# Altium schematic sheet Mainboard_Breakbeam_Interface.SchDoc
size A4
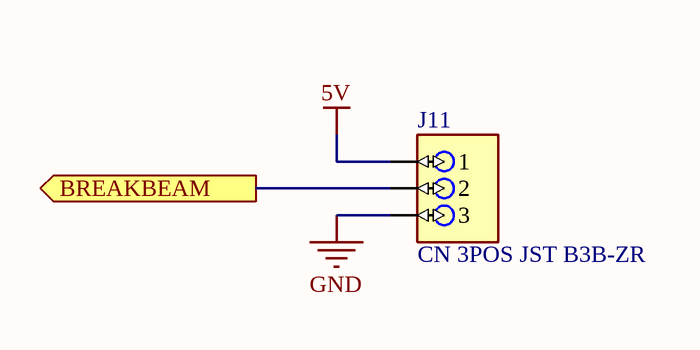
[diagram p0: Mainboard_Breakbeam_Interface.SchDoc]

## Parts
J11  CN 3POS JST B3B-ZR  [CN 3POS JST B3B-ZR]

## Ports
BREAKBEAM (out)

## Nets
5V: J11.1
GND: J11.3
BREAKBEAM: J11.2 ; port BREAKBEAM

## Library data of the parts
J11 = CN 3POS JST B3B-ZR: Connector Header Through Hole 3 position 0.059 (1.50mm); MF: JST Sales; Price: $0.18; MP: B3B-ZR; Package: Bulk; Check_prices: https://www.snapeda.com/parts/B3B-ZR/JST%20Sales%20America%20Inc./view-part/496625/?ref=eda; SnapEDA_Link: https://www.snapeda.com/parts/B3B-ZR/JST%20Sales%20America%20Inc./view-part/496625/?ref=snap; Value: *; Availability: Active; ComponentLink1Description: Digikey Link; ComponentLink1URL: https://www.digikey.com/en/products/detail/jst-sales-america-inc/B3B-ZR(LF)(SN)/926565?utm_source=snapeda&utm_medium=aggregator&utm_campaign=buynow